# EAGLE design breakout-atmega8535 (EAGLE 5.09)
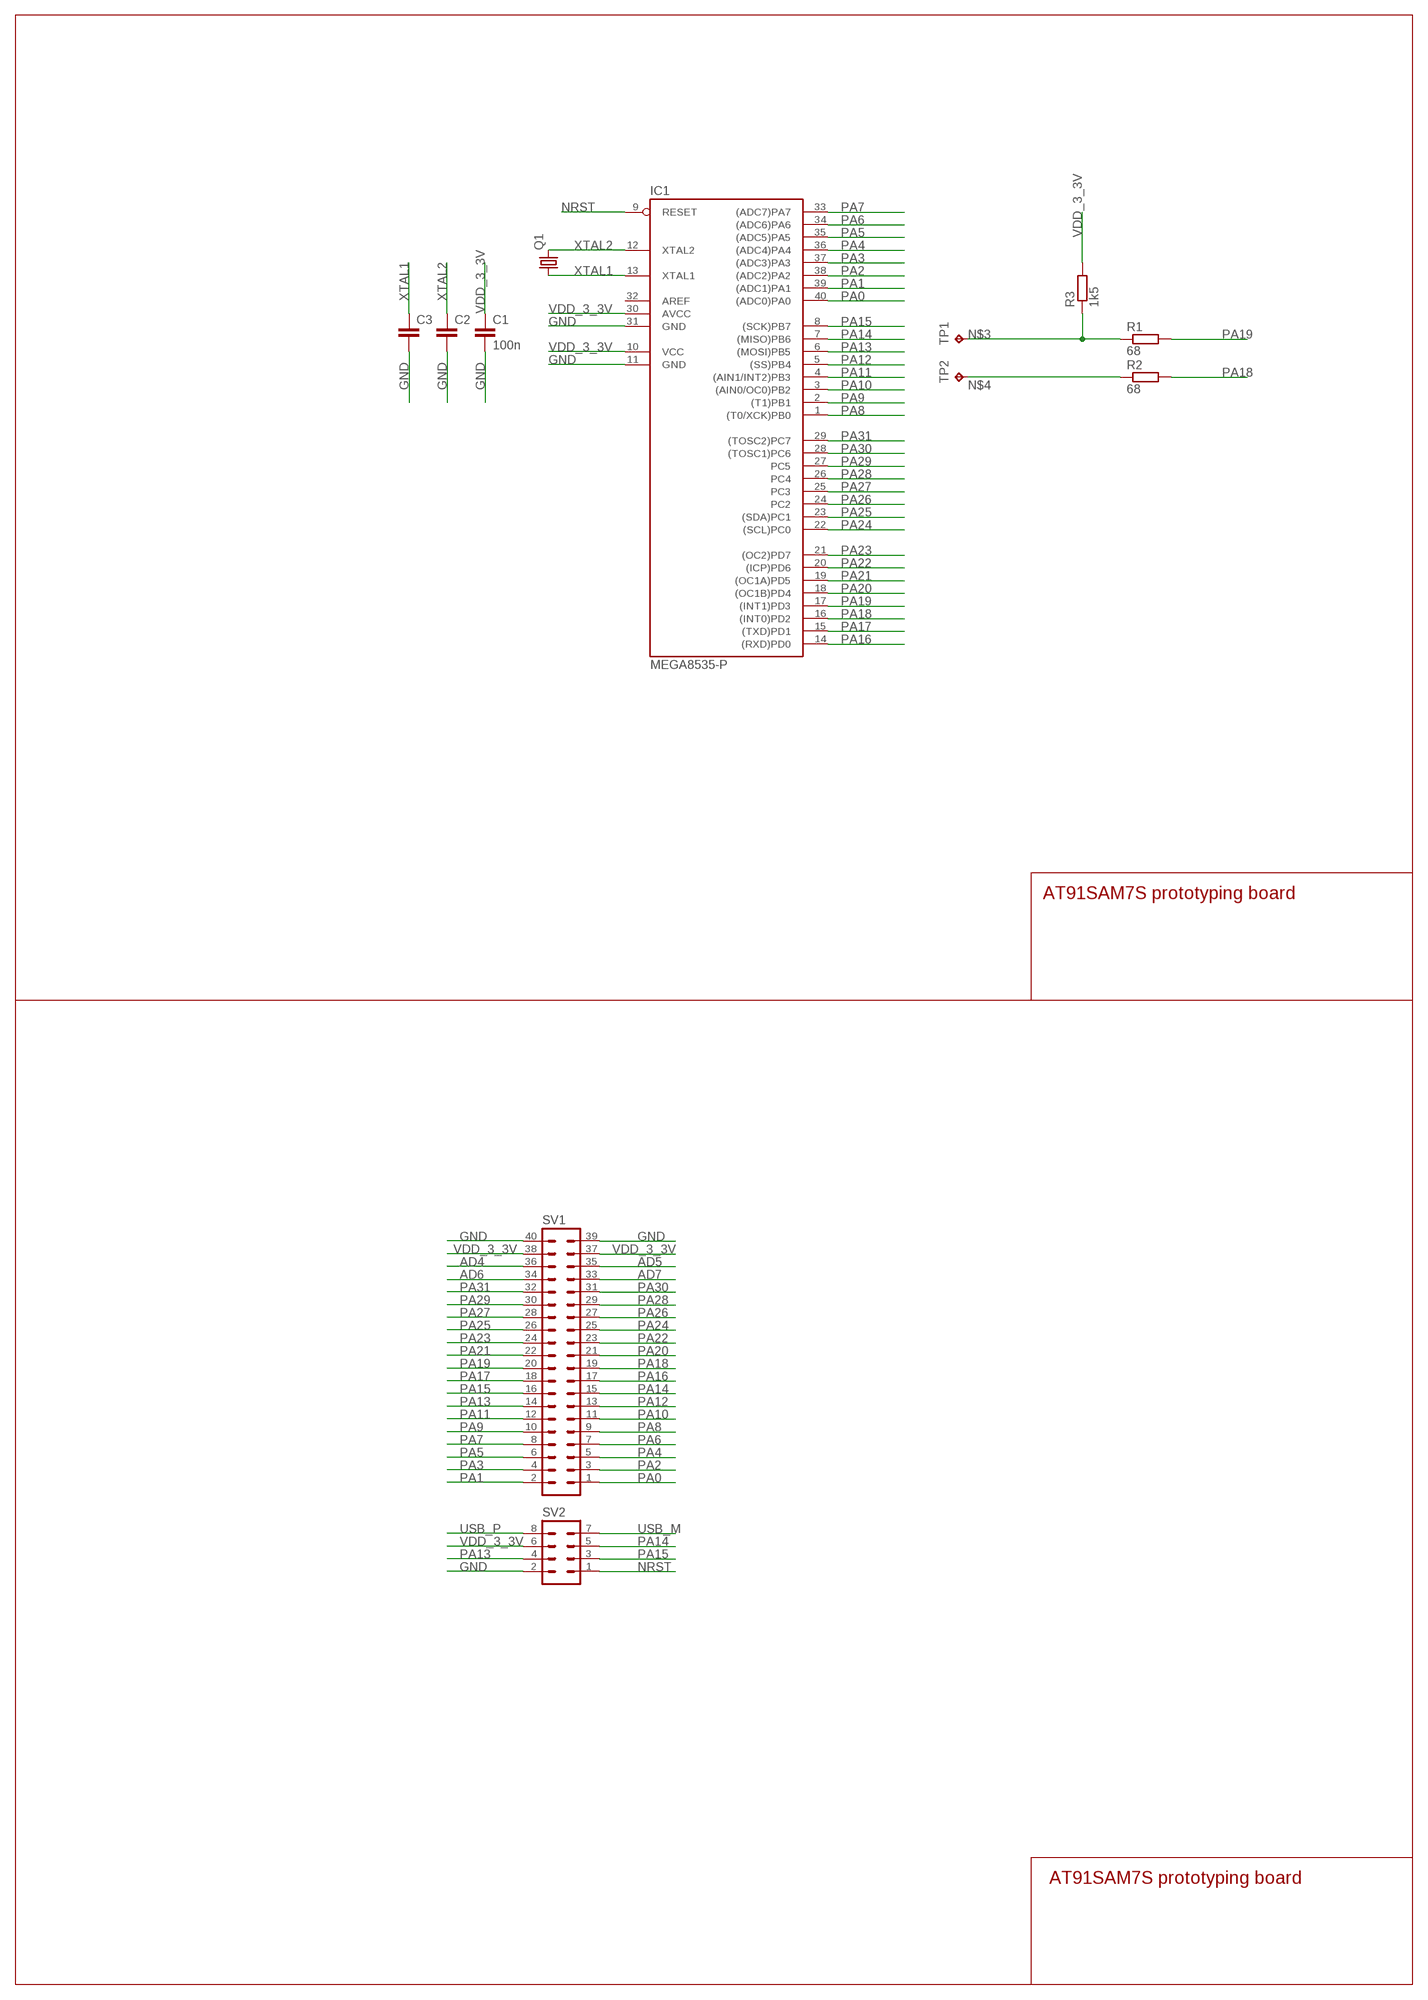
[diagram p0: schematic, sheet 1]

## Parts
C1  100n  C-EUC1206  [C1206]
C2  C-EUC0805  [C0805]
C3  C-EUC0805  [C0805]
IC1  MEGA8535-P  [DIL40]
Q1  CRYSTALHC49S  [HC49/S]
R1  68  R-EU_R0805  [R0805]
R2  68  R-EU_R0805  [R0805]
R3  1k5  R-EU_R0805  [R0805]
SV1  MA20-2  [MA20-2]
SV2  MA04-2  [MA04-2]
TP1  TPB2,54  [B2,54]
TP2  TPB2,54  [B2,54]

## Nets
AD4: SV1.36
AD5: SV1.35
AD6: SV1.34
AD7: SV1.33
GND: C1.2 C2.2 C3.2 IC1.11(GND) IC1.31(GND) SV1.39 SV1.40 SV2.2
N$3: R1.1 R3.1 TP1.TP
N$4: R2.1 TP2.TP
NRST: IC1.9(RESET) SV2.1
PA0: IC1.40((ADC0)PA0) SV1.1
PA1: IC1.39((ADC1)PA1) SV1.2
PA2: IC1.38((ADC2)PA2) SV1.3
PA3: IC1.37((ADC3)PA3) SV1.4
PA4: IC1.36((ADC4)PA4) SV1.5
PA5: IC1.35((ADC5)PA5) SV1.6
PA6: IC1.34((ADC6)PA6) SV1.7
PA7: IC1.33((ADC7)PA7) SV1.8
PA8: IC1.1((T0/XCK)PB0) SV1.9
PA9: IC1.2((T1)PB1) SV1.10
PA10: IC1.3((AIN0/OC0)PB2) SV1.11
PA11: IC1.4((AIN1/INT2)PB3) SV1.12
PA12: IC1.5((SS)PB4) SV1.13
PA13: IC1.6((MOSI)PB5) SV1.14 SV2.4
PA14: IC1.7((MISO)PB6) SV1.15 SV2.5
PA15: IC1.8((SCK)PB7) SV1.16 SV2.3
PA16: IC1.14((RXD)PD0) SV1.17
PA17: IC1.15((TXD)PD1) SV1.18
PA18: IC1.16((INT0)PD2) R2.2 SV1.19
PA19: IC1.17((INT1)PD3) R1.2 SV1.20
PA20: IC1.18((OC1B)PD4) SV1.21
PA21: IC1.19((OC1A)PD5) SV1.22
PA22: IC1.20((ICP)PD6) SV1.23
PA23: IC1.21((OC2)PD7) SV1.24
PA24: IC1.22((SCL)PC0) SV1.25
PA25: IC1.23((SDA)PC1) SV1.26
PA26: IC1.24(PC2) SV1.27
PA27: IC1.25(PC3) SV1.28
PA28: IC1.26(PC4) SV1.29
PA29: IC1.27(PC5) SV1.30
PA30: IC1.28((TOSC1)PC6) SV1.31
PA31: IC1.29((TOSC2)PC7) SV1.32
USB_M: SV2.7
USB_P: SV2.8
VDD_3_3V: C1.1 IC1.10(VCC) IC1.30(AVCC) R3.2 SV1.37 SV1.38 SV2.6
XTAL1: C3.1 IC1.13(XTAL1) Q1.1
XTAL2: C2.1 IC1.12(XTAL2) Q1.2
Unconnected: IC1.32(AREF)

## Notes on the sheet
- AT91SAM7S prototyping board
- AT91SAM7S prototyping board

## Library data of the parts
C1-C3 = rcl:C-EU: CAPACITOR, European symbol
IC1 = atmel:MEGA8535-P: MICROCONTROLLER 8 Kbytes FLASH 512 bytes SRAM 512 bytes EEPROM USART 8-channel 10 bit ADC Source: avr.lbr
Q1 = crystal:CRYSTAL: CRYSTAL
R1-R3 = rcl:R-EU_: RESISTOR, European symbol
SV1 = con-lstb:MA20-2: PIN HEADER
SV2 = con-lstb:MA04-2: PIN HEADER
TP1 TP2 = testpad:TP: Test pad

## Board
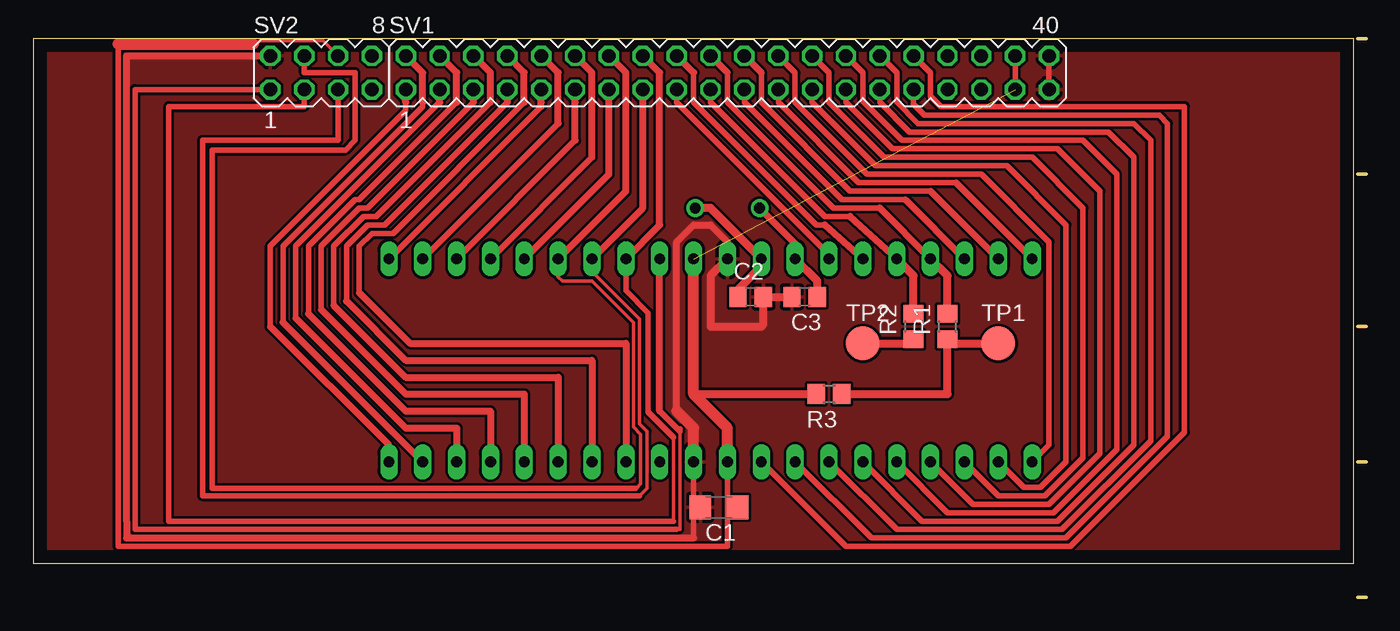
[diagram p1: board, top side]
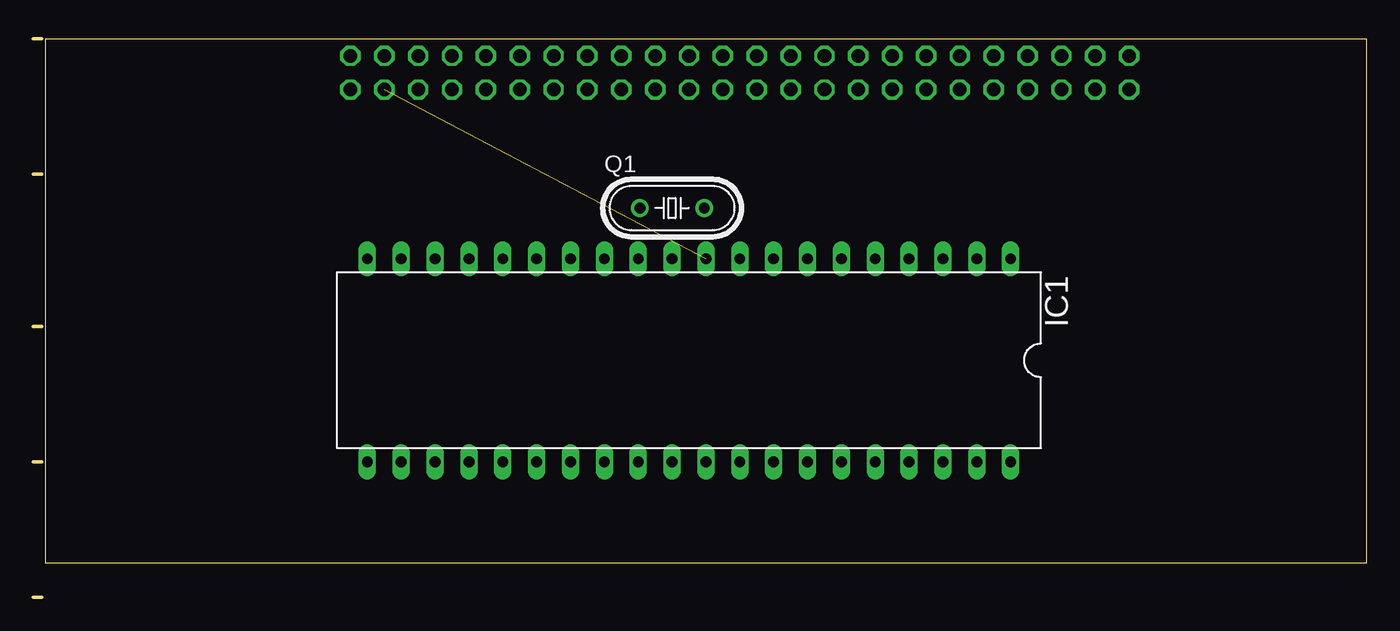
[diagram p2: board, bottom side, seen from below]

Size 99.99 x 41.92 mm. Coordinates in mm from the lower left corner, seen from the top.
Outline: 99.36,41.91 100,41.91
Outline: 99.36,31.75 100,31.75
Outline: 99.36,20.32 100,20.32
Outline: 99.36,10.16 100,10.16
Outline: 99.36,0 100,0
Outline: 0.01,2.54 99.07,2.54 99.07,41.92 0,41.92 0.01,2.54
Copper layers (1*16): Top 0.035mm / dielectric 1.5mm / Bottom 0.035mm
Design rules "default": minimum track width 10mil, minimum drill 24mil, track to track 8mil, track to pad 8mil, pad to pad 8mil, via to via 8mil, smd to smd 8mil, copper to edge 40mil, drill to drill 8mil, minimum pad ring 10mil, minimum via ring 8mil, stop-mask expansion 4mil, vias tented up to drill 0mil, thermal gap 10mil

### Footprints (pad centres in the part's own frame; a part is rotated, then mirrored left to right if it is on the bottom)
C1206 = smd 1.6 x 1.8: 1 -1.4,0; 2 1.4,0
C0805 = smd 1.3 x 1.5: 1 -0.95,0; 2 0.95,0
DIL40 = drill 0.813 long: 1 -24.13,-7.62; 2 -21.59,-7.62; 3 -19.05,-7.62; 4 -16.51,-7.62; 5 -13.97,-7.62; 6 -11.43,-7.62; 7 -8.89,-7.62; 8 -6.35,-7.62; 9 -3.81,-7.62; 10 -1.27,-7.62; 11 1.27,-7.62; 12 3.81,-7.62; 13 6.35,-7.62; 14 8.89,-7.62; 15 11.43,-7.62; 16 13.97,-7.62; 17 16.51,-7.62; 18 19.05,-7.62; 19 21.59,-7.62; 20 24.13,-7.62; 21 24.13,7.62; 22 21.59,7.62; 23 19.05,7.62; 24 16.51,7.62; 25 13.97,7.62; 26 11.43,7.62; 27 8.89,7.62; 28 6.35,7.62; 29 3.81,7.62; 30 1.27,7.62; 31 -1.27,7.62; 32 -3.81,7.62; 33 -6.35,7.62; 34 -8.89,7.62; 35 -11.43,7.62; 36 -13.97,7.62; 37 -16.51,7.62; 38 -19.05,7.62; 39 -21.59,7.62; 40 -24.13,7.62
HC49/S = drill 0.813 round: 1 -2.413,0; 2 2.413,0
R0805 = smd 1.3 x 1.5: 1 -0.95,0; 2 0.95,0
MA20-2 = drill 1.016 octagon: 1 -24.13,-1.27; 2 -24.13,1.27; 3 -21.59,-1.27; 4 -21.59,1.27; 5 -19.05,-1.27; 6 -19.05,1.27; 7 -16.51,-1.27; 8 -16.51,1.27; 9 -13.97,-1.27; 10 -13.97,1.27; 11 -11.43,-1.27; 12 -11.43,1.27; 13 -8.89,-1.27; 14 -8.89,1.27; 15 -6.35,-1.27; 16 -6.35,1.27; 17 -3.81,-1.27; 18 -3.81,1.27; 19 -1.27,-1.27; 20 -1.27,1.27; 21 1.27,-1.27; 22 1.27,1.27; 23 3.81,-1.27; 24 3.81,1.27; 25 6.35,-1.27; 26 6.35,1.27; 27 8.89,-1.27; 28 8.89,1.27; 29 11.43,-1.27; 30 11.43,1.27; 31 13.97,-1.27; 32 13.97,1.27; 33 16.51,-1.27; 34 16.51,1.27; 35 19.05,-1.27; 36 19.05,1.27; 37 21.59,-1.27; 38 21.59,1.27; 39 24.13,-1.27; 40 24.13,1.27
MA04-2 = drill 1.016 octagon: 1 -3.81,-1.27; 2 -3.81,1.27; 3 -1.27,-1.27; 4 -1.27,1.27; 5 1.27,-1.27; 6 1.27,1.27; 7 3.81,-1.27; 8 3.81,1.27
B2,54 = smd 2.54 x 2.54: TP 0,0

### Placement (x,y rotation side)
C1  51.44,6.75 180 top
C2  53.82,22.55 0 top
C3  57.87,22.55 180 top
IC1  50.81,17.79 180 bottom
Q1  52.08,29.22 0 bottom
R1  68.59,20.33 90 top
R2  66.05,20.33 90 top
R3  59.7,15.25 180 top
SV1  52.07,39.38 0 top
SV2  21.6,39.38 0 top
TP1  72.4,19.06 0 top
TP2  62.24,19.06 0 top

### Tracks (layer width: path | path; a pad name or v marks a point on that pad's centre or on a via)
GND
  Top 0.254: C1.2 49.93,6.75 49.54,6.36
  Top 0.406: SV1.39 SV1.40 | 49.54,4.45 49.54,6.36 IC1.31
  Top 0.508: 49.54,4.45 6.99,4.45 6.99,5.72 6.99,40.65 SV2.2 | IC1.11 52.08,26.68 50.81,27.95 49.54,27.95 48.27,26.68 48.27,13.98
  Top 0.61: C3.2 C2.2 54.77,20.48 54.62,20.33 50.81,20.33 50.81,24.14 IC1.11
  Top 0.813: IC1.31 49.54,12.71 48.27,13.98
  pour Top: 0.01,41.92 99.07,41.92 99.07,2.55 0.01,2.55
N$3
  Top 0.61: R3.1 68.58,15.25 R1.1 68.91,19.06 TP1.TP
N$4
  Top 0.61: TP2.TP 65.73,19.06 R2.1
NRST
  Top 0.254: 48.27,5.09 48.5,5.09 48.5,12.47 48.5,12.63
  Top 0.406: 48.27,5.09 7.63,5.09 7.63,8.9 7.63,38.11 SV2.1 | 48.5,12.63 48.5,12.47 47,13.98
  Top 0.508: 47,13.98 IC1.9
PA0
  Top 0.406: 17.79,20.33 17.79,26.36 27.95,36.52 27.95,37.15
  Top 0.508: 27.95,37.15 SV1.1 | 17.79,20.33 26.68,11.44 IC1.40
PA1
  Top 0.406: 18.74,20.64 18.74,26.36 23.5,31.12 29.22,36.84 29.22,37.15
  Top 0.508: 29.22,37.15 29.22,39.38 SV1.2 | IC1.39 18.74,20.64
PA2
  Top 0.406: 19.69,20.96 19.69,26.36 23.82,30.49 30.49,37.15
  Top 0.508: 30.49,37.15 SV1.3 | 19.69,20.96 27.95,12.71 31.76,12.71 IC1.38
PA3  (1 unrouted)
  Top 0.406: 20.64,21.28 20.64,26.36 24.14,29.85 24.45,29.85 31.76,37.15
  Top 0.508: SV1.4 31.76,39.38 31.76,37.15 | 20.64,21.28 27.95,13.98 34.3,13.98 IC1.37
PA4
  Top 0.406: 21.6,21.6 21.6,26.36 24.45,29.22 25.09,29.22 33.03,37.15
  Top 0.508: 33.03,37.15 SV1.5 | 21.6,21.6 27.95,15.25 36.84,15.25 IC1.36
PA5
  Top 0.406: 22.55,21.91 22.55,26.36 24.77,28.58 25.72,28.58 34.3,37.15
  Top 0.508: SV1.6 34.3,39.38 34.3,37.15 | 22.55,21.91 27.95,16.52 39.38,16.52 IC1.35
PA6
  Top 0.406: 23.5,22.23 23.5,26.36 25.09,27.95 26.36,27.95 35.56,37.15 35.57,37.15
  Top 0.508: 35.56,37.15 SV1.7 | 23.5,22.23 27.95,17.79 41.92,17.79 IC1.34
PA7
  Top 0.406: 24.45,22.87 24.45,26.36 25.41,27.31 26.99,27.31 36.84,37.15
  Top 0.508: SV1.8 36.83,39.38 36.84,39.38 36.84,37.15 | 24.45,22.87 28.26,19.06 44.46,19.06 IC1.33
PA8
  Top 0.406: IC1.1 38.11,36.84
  Top 0.508: SV1.9 38.11,37.15 38.11,36.84
PA9
  Top 0.406: IC1.2 39.38,35.57
  Top 0.508: SV1.10 39.37,39.38 39.38,39.38 39.38,37.15 39.38,35.57
PA10
  Top 0.406: IC1.3 40.65,34.3
  Top 0.508: SV1.11 40.65,37.15 40.65,34.3
PA11
  Top 0.406: IC1.4 41.92,33.03
  Top 0.508: SV1.12 41.91,39.38 41.92,39.38 41.92,37.15 41.92,33.03
PA12
  Top 0.508: SV1.13 43.19,37.15 43.19,31.76 IC1.5
PA13
  Top 0.254: 45.17,8.18 45.25,8.18 45.57,8.5 45.57,12.23 45.01,12.79 45.01,20.64 41.92,23.74 39.69,23.74 39.38,24.06 IC1.6
  Top 0.406: SV2.4 20.33,39.38 24.14,39.38 24.14,34.3 23.42,33.58 13.42,33.58 13.42,8.18 45.17,8.18
  Top 0.508: SV1.14 44.45,39.38 44.46,39.38 44.46,37.15 44.46,30.49 IC1.6
PA14
  Top 0.254: 45.49,7.63 46.04,8.18 46.04,12.47 45.49,13.02 45.49,20.88 41.92,24.46 IC1.7
  Top 0.406: SV2.5 22.87,34.3 12.71,34.3 12.71,7.63 44.46,7.63 45.49,7.63
  Top 0.508: SV1.15 45.73,37.15 45.73,29.22 IC1.7
PA15
  Top 0.254: 48.03,5.72 48.03,7.39 48.03,11.99
  Top 0.406: SV2.3 20.33,36.84 10.17,36.84 10.17,5.72 48.03,5.72 | IC1.8 44.46,23.42 44.46,23.03 46.12,21.36 46.12,13.9 48.03,11.99
  Top 0.508: SV1.16 46.99,39.38 47,39.38 47,27.95 IC1.8
PA16
  Top 0.406: IC1.14 59.7,25.73 48.27,37.15 SV1.17
PA17
  Top 0.406: 59.38,27.95 58.74,27.95 49.54,37.15 49.54,39.38
  Top 0.508: IC1.15 59.38,27.95 | 49.54,39.38 SV1.18
PA18
  Top 0.406: 61.28,28.58 59.38,28.58 50.81,37.15 SV1.19
  Top 0.508: SV1.19 | IC1.16 61.28,28.58
  Top 0.61: R2.2 66.05,24.14 IC1.16
PA19
  Top 0.406: 63.51,29.22 60.01,29.22 52.08,37.15 52.08,39.38
  Top 0.508: IC1.17 63.51,29.22 | 52.08,39.38 SV1.20
  Top 0.61: R1.2 68.59,24.14 IC1.17
PA20
  Top 0.406: 65.41,29.85 60.65,29.85 53.35,37.15 SV1.21
  Top 0.508: 65.41,29.85 IC1.18
PA21
  Top 0.406: 67.32,30.49 61.28,30.49 54.62,37.15 54.62,39.38
  Top 0.508: 67.32,30.49 IC1.19 | SV1.22 54.62,39.38
PA22
  Top 0.406: 69.22,31.12 61.92,31.12 55.89,37.15 SV1.23
  Top 0.508: 69.22,31.12 IC1.20
PA23
  Top 0.406: IC1.21 76.21,11.44 76.21,26.68 71.13,31.76 62.55,31.76 57.16,37.15 57.16,39.38 SV1.24
PA24
  Top 0.406: IC1.22 74.3,8.26 75.57,8.26 77.48,10.17 77.48,27.95 73.03,32.39 63.19,32.39 58.43,37.15 SV1.25
  Top 0.508: SV1.25
PA25
  Top 0.406: IC1.23 72.4,7.63 75.89,7.63 78.75,10.49 78.75,29.22 74.94,33.03 63.82,33.03 59.7,37.15 59.7,39.38 SV1.26
PA26
  Top 0.406: IC1.24 70.49,6.99 76.21,6.99 80.02,10.8 80.02,30.49 76.84,33.66 64.46,33.66 60.97,37.15 SV1.27
PA27
  Top 0.406: IC1.25 68.59,6.36 76.52,6.36 81.29,11.12 81.29,31.76 78.75,34.3 65.17,34.3 62.24,37.23 62.24,39.38 SV1.28
PA28
  Top 0.406: IC1.26 66.68,5.72 76.84,5.72 82.56,11.44 82.56,33.03 80.65,34.93 65.73,34.93 63.51,37.15 SV1.29
PA29
  Top 0.406: IC1.27 64.78,5.09 77.16,5.09 83.83,11.76 83.83,34.3 82.56,35.57 66.36,35.57 64.78,37.15 64.78,39.38 64.77,39.38 | 64.77,39.38 SV1.30 | 64.77,39.38 64.78,39.38
PA30
  Top 0.254: SV1.31
  Top 0.406: IC1.28 62.87,4.45 77.48,4.45 85.1,12.07 85.1,35.57 84.46,36.2 66.84,36.2 66.05,37 SV1.31
PA31
  Top 0.406: IC1.29 60.97,3.82 77.79,3.82 86.37,12.39 86.37,36.84 68.11,36.84 67.32,37.63 67.32,39.38 SV1.32
VDD_3_3V  (1 unrouted)
  Top 0.254: SV2.6 21.75,41.76 16.99,41.76 16.75,41.52 16.52,41.52 | C1.1 52.47,6.75 52.08,6.36
  Top 0.406: SV1.37 SV1.38 | IC1.30 52.08,6.36 52.08,3.82 6.36,3.82 6.36,41.52
  Top 0.61: 49.54,15.25 R3.2
  Top 0.813: 6.36,41.52 16.52,41.52 | IC1.10 49.54,15.25 52.08,12.71 IC1.30
XTAL1
  Top 0.508: IC1.13 57.16,26.55 Q1.1
  Top 0.61: C3.1 58.82,23.74 IC1.13
XTAL2
  Top 0.61: Q1.2 50.81,29.22 IC1.12 54.62,24.85 52.87,23.11 C2.1

### Text on the board
tDocu: gnd | mosi | vcc | res | sck | miso
Descript: TOP=BOTTOM BOTTOM=TOP!